# Altium schematic sheet ETHERNET.SchDoc: Ethernet
size 420 x 297 mm; SheetNumber: 11
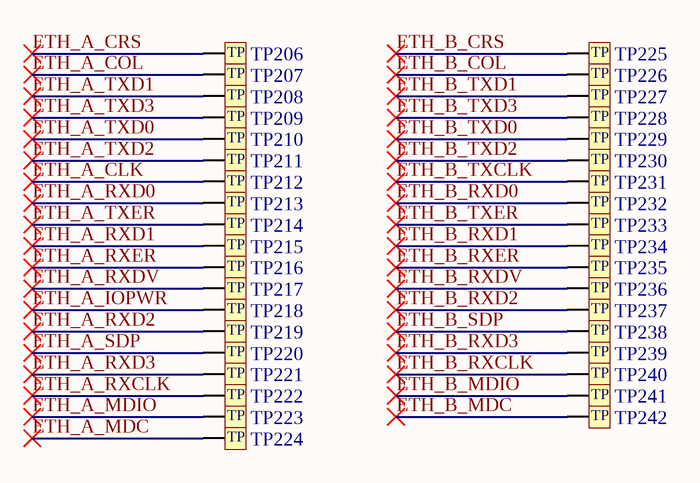
[diagram p0: ETHERNET.SchDoc]

## Parts
TP206  TP_0P8MM  [TP_0P8MM]  (value not drawn)  (no BOM)
TP207  TP_0P8MM  [TP_0P8MM]  (value not drawn)  (no BOM)
TP208  TP_0P8MM  [TP_0P8MM]  (value not drawn)  (no BOM)
TP209  TP_0P8MM  [TP_0P8MM]  (value not drawn)  (no BOM)
TP210  TP_0P8MM  [TP_0P8MM]  (value not drawn)  (no BOM)
TP211  TP_0P8MM  [TP_0P8MM]  (value not drawn)  (no BOM)
TP212  TP_0P8MM  [TP_0P8MM]  (value not drawn)  (no BOM)
TP213  TP_0P8MM  [TP_0P8MM]  (value not drawn)  (no BOM)
TP214  TP_0P8MM  [TP_0P8MM]  (value not drawn)  (no BOM)
TP215  TP_0P8MM  [TP_0P8MM]  (value not drawn)  (no BOM)
TP216  TP_0P8MM  [TP_0P8MM]  (value not drawn)  (no BOM)
TP217  TP_0P8MM  [TP_0P8MM]  (value not drawn)  (no BOM)
TP218  TP_0P8MM  [TP_0P8MM]  (value not drawn)  (no BOM)
TP219  TP_0P8MM  [TP_0P8MM]  (value not drawn)  (no BOM)
TP220  TP_0P8MM  [TP_0P8MM]  (value not drawn)  (no BOM)
TP221  TP_0P8MM  [TP_0P8MM]  (value not drawn)  (no BOM)
TP222  TP_0P8MM  [TP_0P8MM]  (value not drawn)  (no BOM)
TP223  TP_0P8MM  [TP_0P8MM]  (value not drawn)  (no BOM)
TP224  TP_0P8MM  [TP_0P8MM]  (value not drawn)  (no BOM)
TP225  TP_0P8MM  [TP_0P8MM]  (value not drawn)  (no BOM)
TP226  TP_0P8MM  [TP_0P8MM]  (value not drawn)  (no BOM)
TP227  TP_0P8MM  [TP_0P8MM]  (value not drawn)  (no BOM)
TP228  TP_0P8MM  [TP_0P8MM]  (value not drawn)  (no BOM)
TP229  TP_0P8MM  [TP_0P8MM]  (value not drawn)  (no BOM)
TP230  TP_0P8MM  [TP_0P8MM]  (value not drawn)  (no BOM)
TP231  TP_0P8MM  [TP_0P8MM]  (value not drawn)  (no BOM)
TP232  TP_0P8MM  [TP_0P8MM]  (value not drawn)  (no BOM)
TP233  TP_0P8MM  [TP_0P8MM]  (value not drawn)  (no BOM)
TP234  TP_0P8MM  [TP_0P8MM]  (value not drawn)  (no BOM)
TP235  TP_0P8MM  [TP_0P8MM]  (value not drawn)  (no BOM)
TP236  TP_0P8MM  [TP_0P8MM]  (value not drawn)  (no BOM)
TP237  TP_0P8MM  [TP_0P8MM]  (value not drawn)  (no BOM)
TP238  TP_0P8MM  [TP_0P8MM]  (value not drawn)  (no BOM)
TP239  TP_0P8MM  [TP_0P8MM]  (value not drawn)  (no BOM)
TP240  TP_0P8MM  [TP_0P8MM]  (value not drawn)  (no BOM)
TP241  TP_0P8MM  [TP_0P8MM]  (value not drawn)  (no BOM)
TP242  TP_0P8MM  [TP_0P8MM]  (value not drawn)  (no BOM)

## Nets
ETH_A_CLK: TP212.1
ETH_A_COL: TP207.1
ETH_A_CRS: TP206.1
ETH_A_IOPWR: TP218.1
ETH_A_MDC: TP224.1
ETH_A_MDIO: TP223.1
ETH_A_RXCLK: TP222.1
ETH_A_RXD0: TP213.1
ETH_A_RXD1: TP215.1
ETH_A_RXD2: TP219.1
ETH_A_RXD3: TP221.1
ETH_A_RXDV: TP217.1
ETH_A_RXER: TP216.1
ETH_A_SDP: TP220.1
ETH_A_TXD0: TP210.1
ETH_A_TXD1: TP208.1
ETH_A_TXD2: TP211.1
ETH_A_TXD3: TP209.1
ETH_A_TXER: TP214.1
ETH_B_COL: TP226.1
ETH_B_CRS: TP225.1
ETH_B_MDC: TP242.1
ETH_B_MDIO: TP241.1
ETH_B_RXCLK: TP240.1
ETH_B_RXD0: TP232.1
ETH_B_RXD1: TP234.1
ETH_B_RXD2: TP237.1
ETH_B_RXD3: TP239.1
ETH_B_RXDV: TP236.1
ETH_B_RXER: TP235.1
ETH_B_SDP: TP238.1
ETH_B_TXCLK: TP231.1
ETH_B_TXD0: TP229.1
ETH_B_TXD1: TP227.1
ETH_B_TXD2: TP230.1
ETH_B_TXD3: TP228.1
ETH_B_TXER: TP233.1

## Notes on the sheet
- PROJECT
- SIZE
- FILE NAME
- A3
- TITLE
- SHEET
- OF
- REV
- (in symbol TP_0P8MM) TP

## Library data of the parts
TP206-TP242 = TP_0P8MM: OSM Footprint 0P8 LGA Ball